# Altium schematic sheet MicroInterface.SchDoc
size A
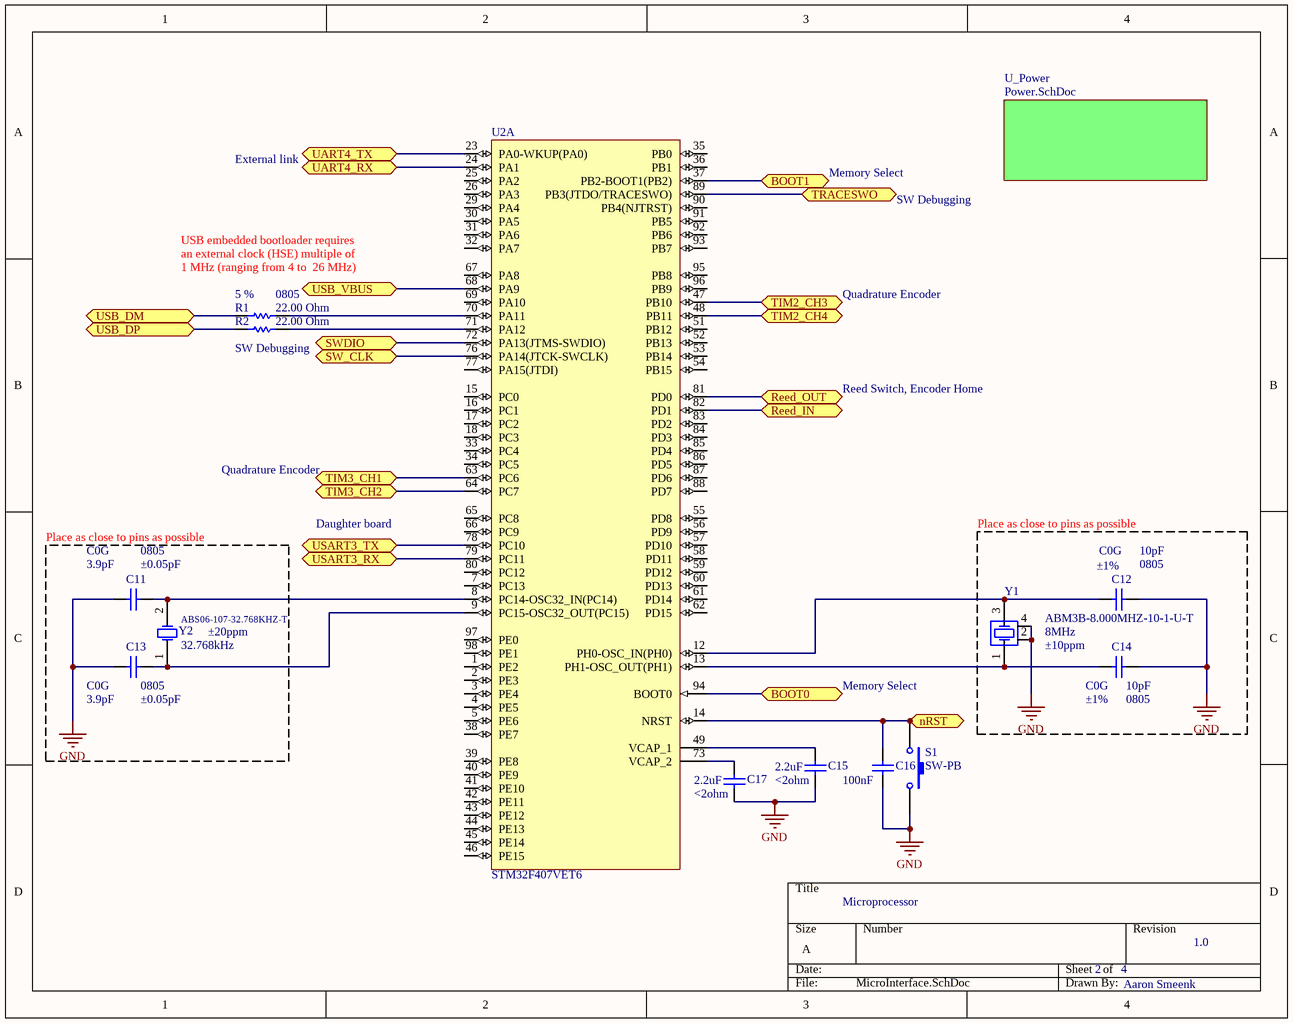
[diagram p0: MicroInterface.SchDoc]

## Parts
C11  value 3.9pF  Case-EIA: 0805  Tolerance: ±0.05pF  Temperature Coefficient: C0G  [CAPC0805(2012)75_L]  (hidden comment: CAP 3.9pF 10V 0805(2012))
C12  value 10pF  Tolerance: ±1%  Case-EIA: 0805  Temperature Coefficient: C0G  [CAPC0805(2012)100_M]  (hidden comment: CAP 10pF 10V 0805(2012))
C13  value 3.9pF  Case-EIA: 0805  Tolerance: ±0.05pF  Temperature Coefficient: C0G  [CAPC0805(2012)75_L]  (hidden comment: CAP 3.9pF 10V 0805(2012))
C14  value 10pF  Tolerance: ±1%  Case-EIA: 0805  Temperature Coefficient: C0G  [CAPC0805(2012)100_M]  (hidden comment: CAP 10pF 10V 0805(2012))
C15  value 2.2uF  ESR: <2ohm  [CAPC0805(2012)145_M]  (hidden comment: CAP 1.5uF 6.3V 0805(2012))
C16  value 100nF  [CAPC0805(2012)145_M]  (hidden comment: CAP 100nF 0805(2012))
C17  value 2.2uF  ESR: <2ohm  [CAPC0805(2012)145_M]  (hidden comment: CAP 1.5uF 6.3V 0805(2012))
R1  value 22.00 Ohm  Tolerance: 5 %  Case-EIA: 0805  [RESC0805(2012)_M]  (hidden comment: 22R 5% 0805(2012))
R2  value 22.00 Ohm  [RESC0805(2012)_M]  (hidden comment: 22R 5% 0805(2012))
S1  SW-PB  [SPST-2]
U2  STM32F407VET6  [STM-LQFP100_M]  (part A of 2)
Y1  ABM3B-8.000MHZ-10-1-U-T  Frequency: 8MHz  Frequency Stability: ±10ppm  [ABM3B Series]
Y2  ABS06-107-32.768KHZ-T  Frequency: 32.768kHz  Frequency Tolerance: ±20ppm  [ABS06-107]

## Blocks framed on the sheet
Place as close to pins as possible: C11 C13 Y2
Place as close to pins as possible: C12 C14 Y1

## Sub-sheets
U_Power = Power.SchDoc: no entries

## Ports
BOOT0, BOOT1, nRST, Reed_IN, Reed_OUT, SW_CLK, SWDIO, TIM2_CH3, TIM2_CH4, TIM3_CH1, TIM3_CH2, TRACESWO, UART4_RX, UART4_TX, USART3_RX, USART3_TX, USB_DM, USB_DP, USB_VBUS

## Nets
GND: C11.1 C12.2 C13.1 C14.2 C15.1 C16.1 C17.1 S1.2 Y1.2 Y1.4
BOOT0: U2.94(BOOT0) ; port BOOT0
BOOT1: U2.37(PB2-BOOT1(PB2)) ; port BOOT1
nRST: C16.2 S1.1 U2.14(NRST) ; port nRST
Reed_IN: U2.82(PD1) ; port Reed_IN
Reed_OUT: U2.81(PD0) ; port Reed_OUT
SW_CLK: U2.76(PA14(JTCK-SWCLK)) ; port SW_CLK
SWDIO: U2.72(PA13(JTMS-SWDIO)) ; port SWDIO
TIM2_CH3: U2.47(PB10) ; port TIM2_CH3
TIM2_CH4: U2.48(PB11) ; port TIM2_CH4
TIM3_CH1: U2.63(PC6) ; port TIM3_CH1
TIM3_CH2: U2.64(PC7) ; port TIM3_CH2
TRACESWO: U2.89(PB3(JTDO/TRACESWO)) ; port TRACESWO
UART4_RX: U2.24(PA1) ; port UART4_RX
UART4_TX: U2.23(PA0-WKUP(PA0)) ; port UART4_TX
USART3_RX: U2.79(PC11) ; port USART3_RX
USART3_TX: U2.78(PC10) ; port USART3_TX
USB_DM: R1.1 ; port USB_DM
USB_DP: R2.1 ; port USB_DP
USB_VBUS: U2.68(PA9) ; port USB_VBUS
NetC11_2: C11.2 U2.8(PC14-OSC32_IN(PC14)) Y2.2
NetC12_1: C12.1 U2.12(PH0-OSC_IN(PH0)) Y1.3
NetC13_2: C13.2 U2.9(PC15-OSC32_OUT(PC15)) Y2.1
NetC14_1: C14.1 U2.13(PH1-OSC_OUT(PH1)) Y1.1
NetC15_2: C15.2 U2.49(VCAP_1)
NetC17_2: C17.2 U2.73(VCAP_2)
NetR1_2: R1.2 U2.70(PA11)
NetR2_2: R2.2 U2.71(PA12)

Not connected (* = marked no-connect by the designer): U2 1(PE2) 2(PE3) 3(PE4) 4(PE5) 5(PE6) 7(PC13) 15(PC0) 16(PC1) 17(PC2) 18(PC3) 25(PA2) 26(PA3) 29(PA4) 30(PA5) 31(PA6) 32(PA7) 33(PC4) 34(PC5) 35(PB0) 36(PB1) 38(PE7) 39(PE8) 40(PE9) 41(PE10) 42(PE11) 43(PE12) 44(PE13) 45(PE14) 46(PE15) 51(PB12) 52(PB13) 53(PB14) 54(PB15) 55(PD8) 56(PD9) 57(PD10) 58(PD11) 59(PD12) 60(PD13) 61(PD14) 62(PD15) 65(PC8) 66(PC9) 67(PA8) 69(PA10) 77(PA15(JTDI)) 80(PC12) 83(PD2) 84(PD3) 85(PD4) 86(PD5) 87(PD6) 88(PD7) 90(PB4(NJTRST)) 91(PB5) 92(PB6) 93(PB7) 95(PB8) 96(PB9) 97(PE0) 98(PE1)

## Notes on the sheet
- External link
- Memory Select
- SW Debugging
- USB embedded bootloader requires
- an external clock (HSE) multiple of
- 1 MHz (ranging from 4 to  26 MHz)
- Quadrature Encoder
- (near R2) SW Debugging
- Reed Switch, Encoder Home
- Daughter board
- Microprocessor
- 2
- 4
- 1.0
- Aaron Smeenk

## Library data of the parts
C11 C13 = CMP-1036-00455-1: CAP 3.9pF 10V ±0.1pF 0805 (2012 Metric) Thickness 0.75mm SMD; Manufacturer Part Number: GRM1555C1H4R0WA01D; Case-Metric: 2012; Rated Voltage: 10 V; Max Thickness: 0.75 mm; Technology: SMT
C12 C14 = CMP-1036-00821-1: CAP 10pF 10V ±0.25pF 0805 (2012 Metric) Thickness 1mm SMD; Case-Metric: 2012; Max Thickness: 1 mm; Rated Voltage: 10 V; Technology: SMT
C15 C17 = CMP-1036-04784-1: CAP 1.5uF 6.3V ±20% 0805 (2012 Metric) Thickness 1.45mm SMD; Case-EIA: 0805; Case-Metric: 2012; Max Thickness: 1.45 mm; Technology: SMT; Rated Voltage: 6.3 V; Tolerance: ±20%
C16 = CMP-1036-04784-1: CAP 1.5uF 6.3V ±20% 0805 (2012 Metric) Thickness 1.45mm SMD; Case-EIA: 0805; Case-Metric: 2012; ESR: <2ohm; Max Thickness: 1.45 mm; Technology: SMT; Rated Voltage: 6.3 V; Tolerance: ±20%
R1 = CMP-1013-00034-1: 22R 0.125W 5% 0805 (2012 Metric)  SMD; Case-Metric: 2012; Power: 0.125 W; Technology: SMT
R2 = CMP-1013-00034-1: 22R 0.125W 5% 0805 (2012 Metric)  SMD; Case-Metric: 2012; Case-EIA: 0805; Power: 0.125 W; Technology: SMT; Tolerance: 5 %
S1 = SW-PB: Switch; Published: 24-Mar-1999; LatestRevisionDate: 17-Jul-2002; LatestRevisionNote: Re-released for DXP Platform.; PackageReference: SPST-2; Publisher: Altium Limited; PackageDescription: Switch; 2 Leads
U2 = CMP-0243-00016-3: ARM Cortex-M4 32-bit MCU+FPU, 210 DMIPS, 512 kB Flash, 192 kB Internal RAM, 82 I/Os, 100-pin LQFP, -40 to 85 degC, Tray; Manufacturer: STMicroelectronics; Supply Voltage(Vcc) max (V): 3.6; Supply Voltage(Vcc) min (V): 1.8; I/Os (High Current): 82; FLASH Size (Prog) (kB): 512; Operating Frequency(F) (Processor speed) (MHz): 168; D/A Converter: 2x12-bit; Internal RAM Size (kB): 192; PackageReference: LQFP100; Core: ARM Cortex-M4; ComponentLink1URL: http://www.st.com/web/en/home.html; ComponentLink1Description: Manufacturer URL; DatasheetVersion: Rev. 4; Packing: Tray; Mounting Technology: Surface Mount; ComponentLink2Description: Datasheet; ComponentLink2URL: http://www.st.com/st-web-ui/static/active/en/resource/technical/document/datasheet/DM00037051.pdf; ComponentLink3Description: Package Specification; PartNumber: STM32F407VET6; PackageVersion: Rev. 1, 06/2013; PackageDescription: 100-Pin Low Profile Quad Flat Package, 14 x 14 mm Body, 0.5 mm Pitch; ComponentLink3URL: http://www.st.com/st-web-ui/static/active/en/resource/technical/document/data_brief/DM00071938.pdf; PartId: 1
Y1 = ABM3B Series: CRYSTAL 8MHZ 10PF SMD; ESR (Equivalent Series Resistance): 200 Ohm; Operating Mode: Fundamental; Frequency Tolerance: ±10ppm; Load Capacitance: 10pF; Operating Temperature: -10°C ~ 60°C; Package / Case: 4-SMD, No Lead (DFN, LCC)
Y2 = ABS06-107: CRYSTAL 32.768 KHZ 4PF SMD; ESR (Equivalent Series Resistance): 60 kOhm; Operating Mode: Fundamental; Type: kHz Crystal (Tuning Fork); Load Capacitance: 4pF; Operating Temperature: -40°C ~ 85°C; Package / Case: 0805 (2012 Metric); Size / Dimension: 0.079" L x 0.047" W (2.00mm x 1.20mm); Height: 0.024" (0.60mm)